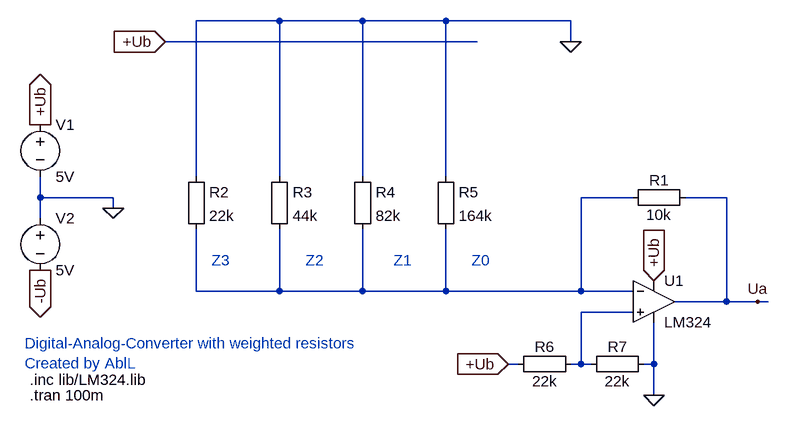
[diagram p0: schematic DAC-4Bit-gew-Wid.asc]
DAC-4Bit-gew-Wid.asc, the LTspice schematic file:
Version 4
SHEET 1 1604 680
WIRE 48 -240 -80 -240
WIRE 176 -240 48 -240
WIRE 304 -240 176 -240
WIRE 496 -240 304 -240
WIRE 352 -208 -128 -208
WIRE 496 -208 496 -240
WIRE -80 0 -80 -240
WIRE 48 0 48 -240
WIRE 176 0 176 -240
WIRE 304 0 304 -240
WIRE -320 32 -320 0
WIRE -208 32 -320 32
WIRE 592 32 512 32
WIRE 736 32 672 32
WIRE -208 48 -208 32
WIRE -320 64 -320 32
WIRE -80 176 -80 80
WIRE 48 176 48 80
WIRE 48 176 -80 176
WIRE 176 176 176 80
WIRE 176 176 48 176
WIRE 304 176 304 80
WIRE 304 176 176 176
WIRE 512 176 512 32
WIRE 512 176 304 176
WIRE 592 176 512 176
WIRE 736 192 736 32
WIRE 736 192 656 192
WIRE 784 192 736 192
WIRE 800 192 784 192
WIRE 592 208 512 208
WIRE 416 288 400 288
WIRE 512 288 512 208
WIRE 512 288 496 288
WIRE 528 288 512 288
WIRE 624 288 624 224
WIRE 624 288 608 288
WIRE 624 336 624 288
FLAG -208 48 0
FLAG -320 -80 +Ub
IOPIN -320 -80 Out
FLAG 784 192 Ua
FLAG 624 160 +Ub
IOPIN 624 160 In
FLAG -320 144 -Ub
IOPIN -320 144 Out
FLAG 496 -208 0
FLAG -128 -208 +Ub
IOPIN -128 -208 In
FLAG 400 288 +Ub
IOPIN 400 288 In
FLAG 624 336 0
SYMBOL voltage -320 -96 R0
WINDOW 123 0 0 Left 0
WINDOW 39 0 0 Left 0
SYMATTR InstName V1
SYMATTR Value 5V
SYMBOL Opamps\\opamp2 624 128 R0
SYMATTR InstName U1
SYMATTR Value LM324
SYMBOL voltage -320 48 R0
WINDOW 123 0 0 Left 0
WINDOW 39 0 0 Left 0
SYMATTR InstName V2
SYMATTR Value 5V
SYMBOL Misc\\EuropeanResistor -96 -16 R0
SYMATTR InstName R2
SYMATTR Value 22k
SYMBOL Misc\\EuropeanResistor 32 -16 R0
SYMATTR InstName R3
SYMATTR Value 44k
SYMBOL Misc\\EuropeanResistor 160 -16 R0
SYMATTR InstName R4
SYMATTR Value 82k
SYMBOL Misc\\EuropeanResistor 288 -16 R0
SYMATTR InstName R5
SYMATTR Value 164k
SYMBOL Misc\\EuropeanResistor 400 304 R270
WINDOW 0 27 56 VTop 2
WINDOW 3 5 56 VBottom 2
SYMATTR InstName R6
SYMATTR Value 22k
SYMBOL Misc\\EuropeanResistor 512 304 R270
WINDOW 0 27 56 VTop 2
WINDOW 3 5 56 VBottom 2
SYMATTR InstName R7
SYMATTR Value 22k
SYMBOL Misc\\EuropeanResistor 688 16 R90
WINDOW 0 5 56 VBottom 2
WINDOW 3 27 56 VTop 2
SYMATTR InstName R1
SYMATTR Value 10k
TEXT -336 336 Left 2 !.tran 100m
TEXT -336 312 Left 2 !.inc lib/LM324.lib
TEXT -56 128 Left 2 ;Z3
TEXT 88 128 Left 2 ;Z2
TEXT 224 128 Left 2 ;Z1
TEXT 344 128 Left 2 ;Z0
TEXT -344 256 Left 2 ;Digital-Analog-Converter with weighted resistors\nCreated by AblL

The netlist it stands for:
* DAC-4Bit-gew-Wid.asc
V1 +Ub 0 5V
XU1 N002 N001 +Ub 0 Ua LM324  ; pins In+ In- V+ V- OUT
V2 0 -Ub 5V
R2 0 N001 22k
R3 0 N001 44k
R4 0 N001 82k
R5 0 N001 164k
R6 +Ub N002 22k
R7 N002 0 22k
R1 Ua N001 10k
.tran 100m
.inc lib/LM324.lib
* Z3
* Z2
* Z1
* Z0
* Digital-Analog-Converter with weighted resistors
* Created by AblL
.backanno
.end